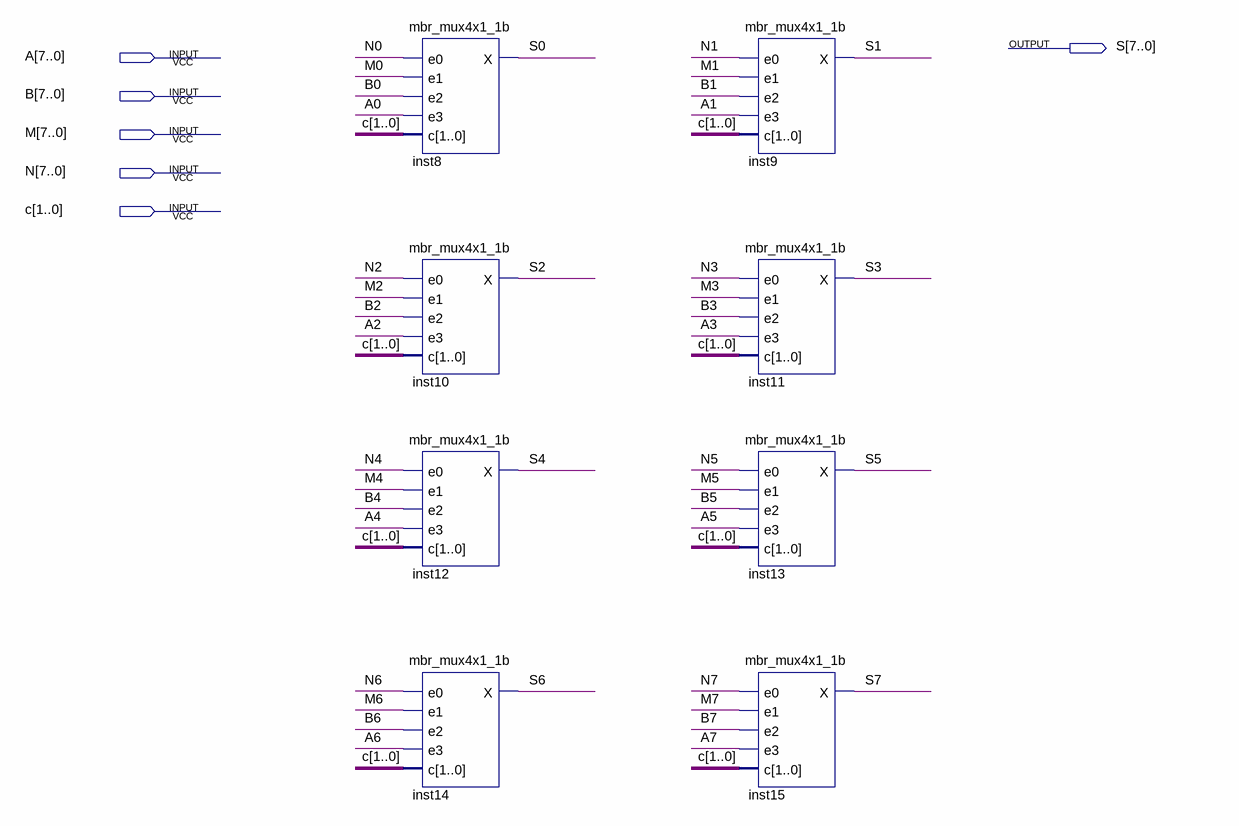
[diagram p0: schematic sheet]
// Quartus schematic mbr_mux4x1_8b.bdf as structural Verilog: 8 symbols, 6 pins
module mbr_mux4x1_8b (
  input  [7:0] A,
  input  [7:0] B,
  input  [7:0] M,
  input  [7:0] N,
  input  [1:0] c,
  output [7:0] S
);

  mbr_mux4x1_1b inst8 (.e0(N[0]), .e1(M[0]), .e2(B[0]), .e3(A[0]), .c(c), .X(S[0]));
  mbr_mux4x1_1b inst10 (.e0(N[2]), .e1(M[2]), .e2(B[2]), .e3(A[2]), .c(c), .X(S[2]));
  mbr_mux4x1_1b inst12 (.e0(N[4]), .e1(M[4]), .e2(B[4]), .e3(A[4]), .c(c), .X(S[4]));
  mbr_mux4x1_1b inst14 (.e0(N[6]), .e1(M[6]), .e2(B[6]), .e3(A[6]), .c(c), .X(S[6]));
  mbr_mux4x1_1b inst9 (.e0(N[1]), .e1(M[1]), .e2(B[1]), .e3(A[1]), .c(c), .X(S[1]));
  mbr_mux4x1_1b inst11 (.e0(N[3]), .e1(M[3]), .e2(B[3]), .e3(A[3]), .c(c), .X(S[3]));
  mbr_mux4x1_1b inst13 (.e0(N[5]), .e1(M[5]), .e2(B[5]), .e3(A[5]), .c(c), .X(S[5]));
  mbr_mux4x1_1b inst15 (.e0(N[7]), .e1(M[7]), .e2(B[7]), .e3(A[7]), .c(c), .X(S[7]));
endmodule
